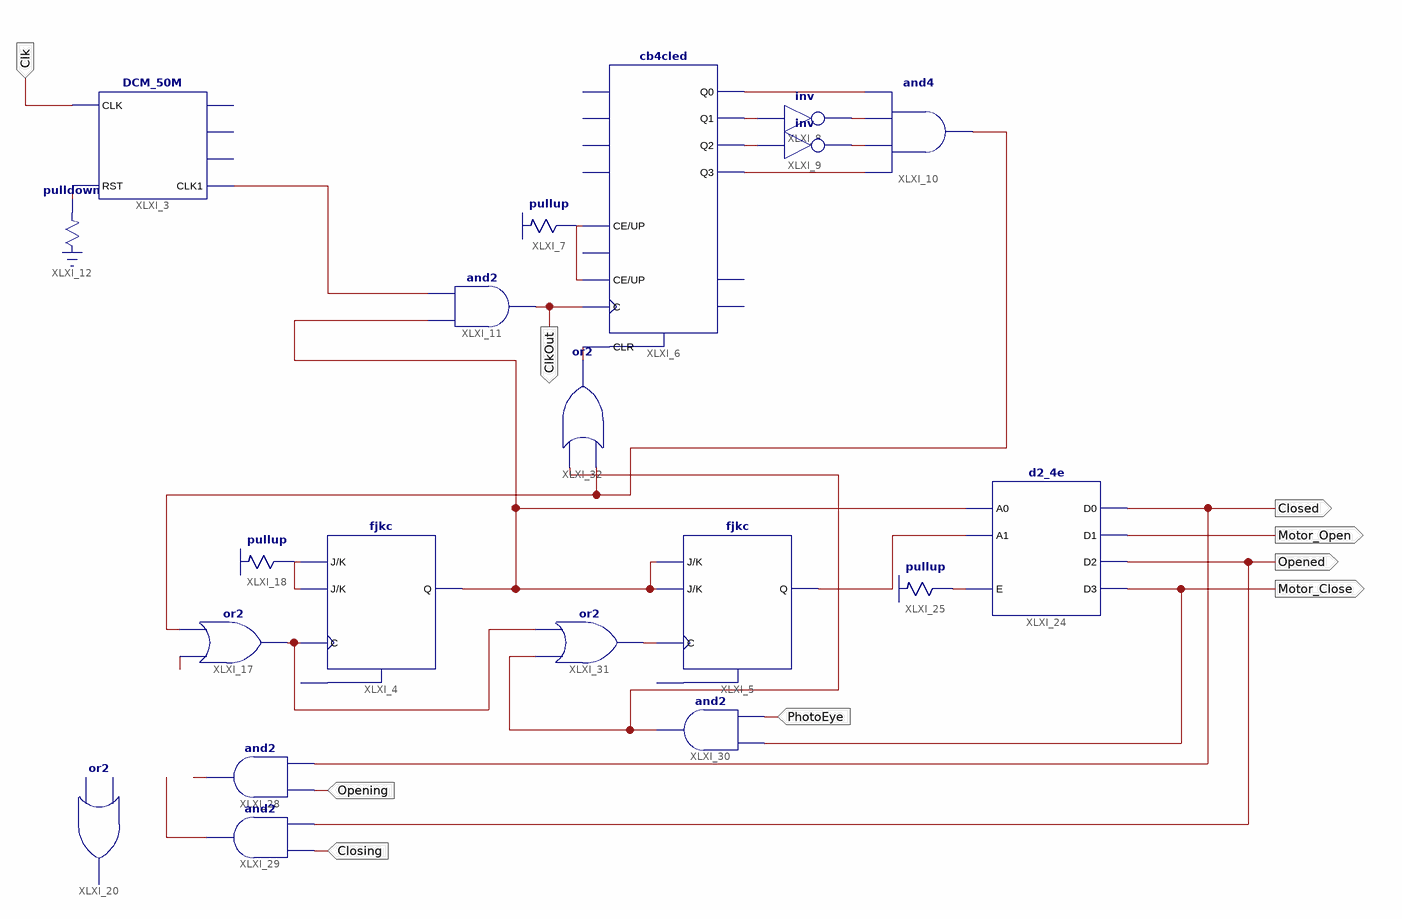
[diagram p0: schematic sheet 1]
// Xilinx ISE schematic Lab9Exp2.sch (spartan3e) as structural Verilog: 20 symbols, 9 ports
module Lab9Exp2 (
  input  Clk,
  input  Closing,
  input  Opening,
  input  PhotoEye,
  output ClkOut,
  output Closed,
  output Motor_Open,
  output Opened,
  output Motor_Close
);

  wire XLXN_1, XLXN_2, XLXN_3, XLXN_4, XLXN_5, XLXN_6, XLXN_7, XLXN_11, XLXN_12, XLXN_15, XLXN_20, XLXN_33,
       XLXN_43, XLXN_44, XLXN_45, XLXN_46, XLXN_49, XLXN_50, XLXN_53, XLXN_55, XLXN_56;

  DCM_50M XLXI_3 (.CLK(Clk), .RST(XLXN_11), .CLK1(XLXN_12));  // open: CLK1M, CLK10k, CLK1k
  cb4cled XLXI_6 (
    .C(ClkOut), .CE(XLXN_1), .CLR(XLXN_53), .UP(XLXN_1), .Q0(XLXN_6), .Q1(XLXN_2), .Q2(XLXN_3), .Q3(XLXN_7));  // open: D0, D1, D2, D3, L, CEO, TC
  \pullup  XLXI_7 (.O(XLXN_1));
  not XLXI_8 (XLXN_5, XLXN_2);
  not XLXI_9 (XLXN_4, XLXN_3);
  and XLXI_10 (XLXN_55, XLXN_7, XLXN_4, XLXN_5, XLXN_6);
  and XLXI_11 (ClkOut, XLXN_43, XLXN_12);
  \pulldown  XLXI_12 (.O(XLXN_11));
  fjkc XLXI_4 (.C(XLXN_49), .J(XLXN_15), .K(XLXN_15), .Q(XLXN_43));  // open: CLR
  fjkc XLXI_5 (.C(XLXN_50), .J(XLXN_43), .K(XLXN_43), .Q(XLXN_44));  // open: CLR
  or XLXI_17 (XLXN_49, XLXN_20, XLXN_55);
  \pullup  XLXI_18 (.O(XLXN_15));
  or XLXI_20 (XLXN_20, XLXN_46, XLXN_45);
  d2_4e XLXI_24 (.A0(XLXN_43), .A1(XLXN_44), .E(XLXN_33), .D0(Closed), .D1(Motor_Open), .D2(Opened), .D3(Motor_Close));
  \pullup  XLXI_25 (.O(XLXN_33));
  and XLXI_28 (XLXN_45, Closed, Opening);
  and XLXI_29 (XLXN_46, Opened, Closing);
  and XLXI_30 (XLXN_56, PhotoEye, Motor_Close);
  or XLXI_31 (XLXN_50, XLXN_56, XLXN_49);
  or XLXI_32 (XLXN_53, XLXN_55, XLXN_56);
endmodule
